# EAGLE design IOIO Rover (EAGLE 5.11)
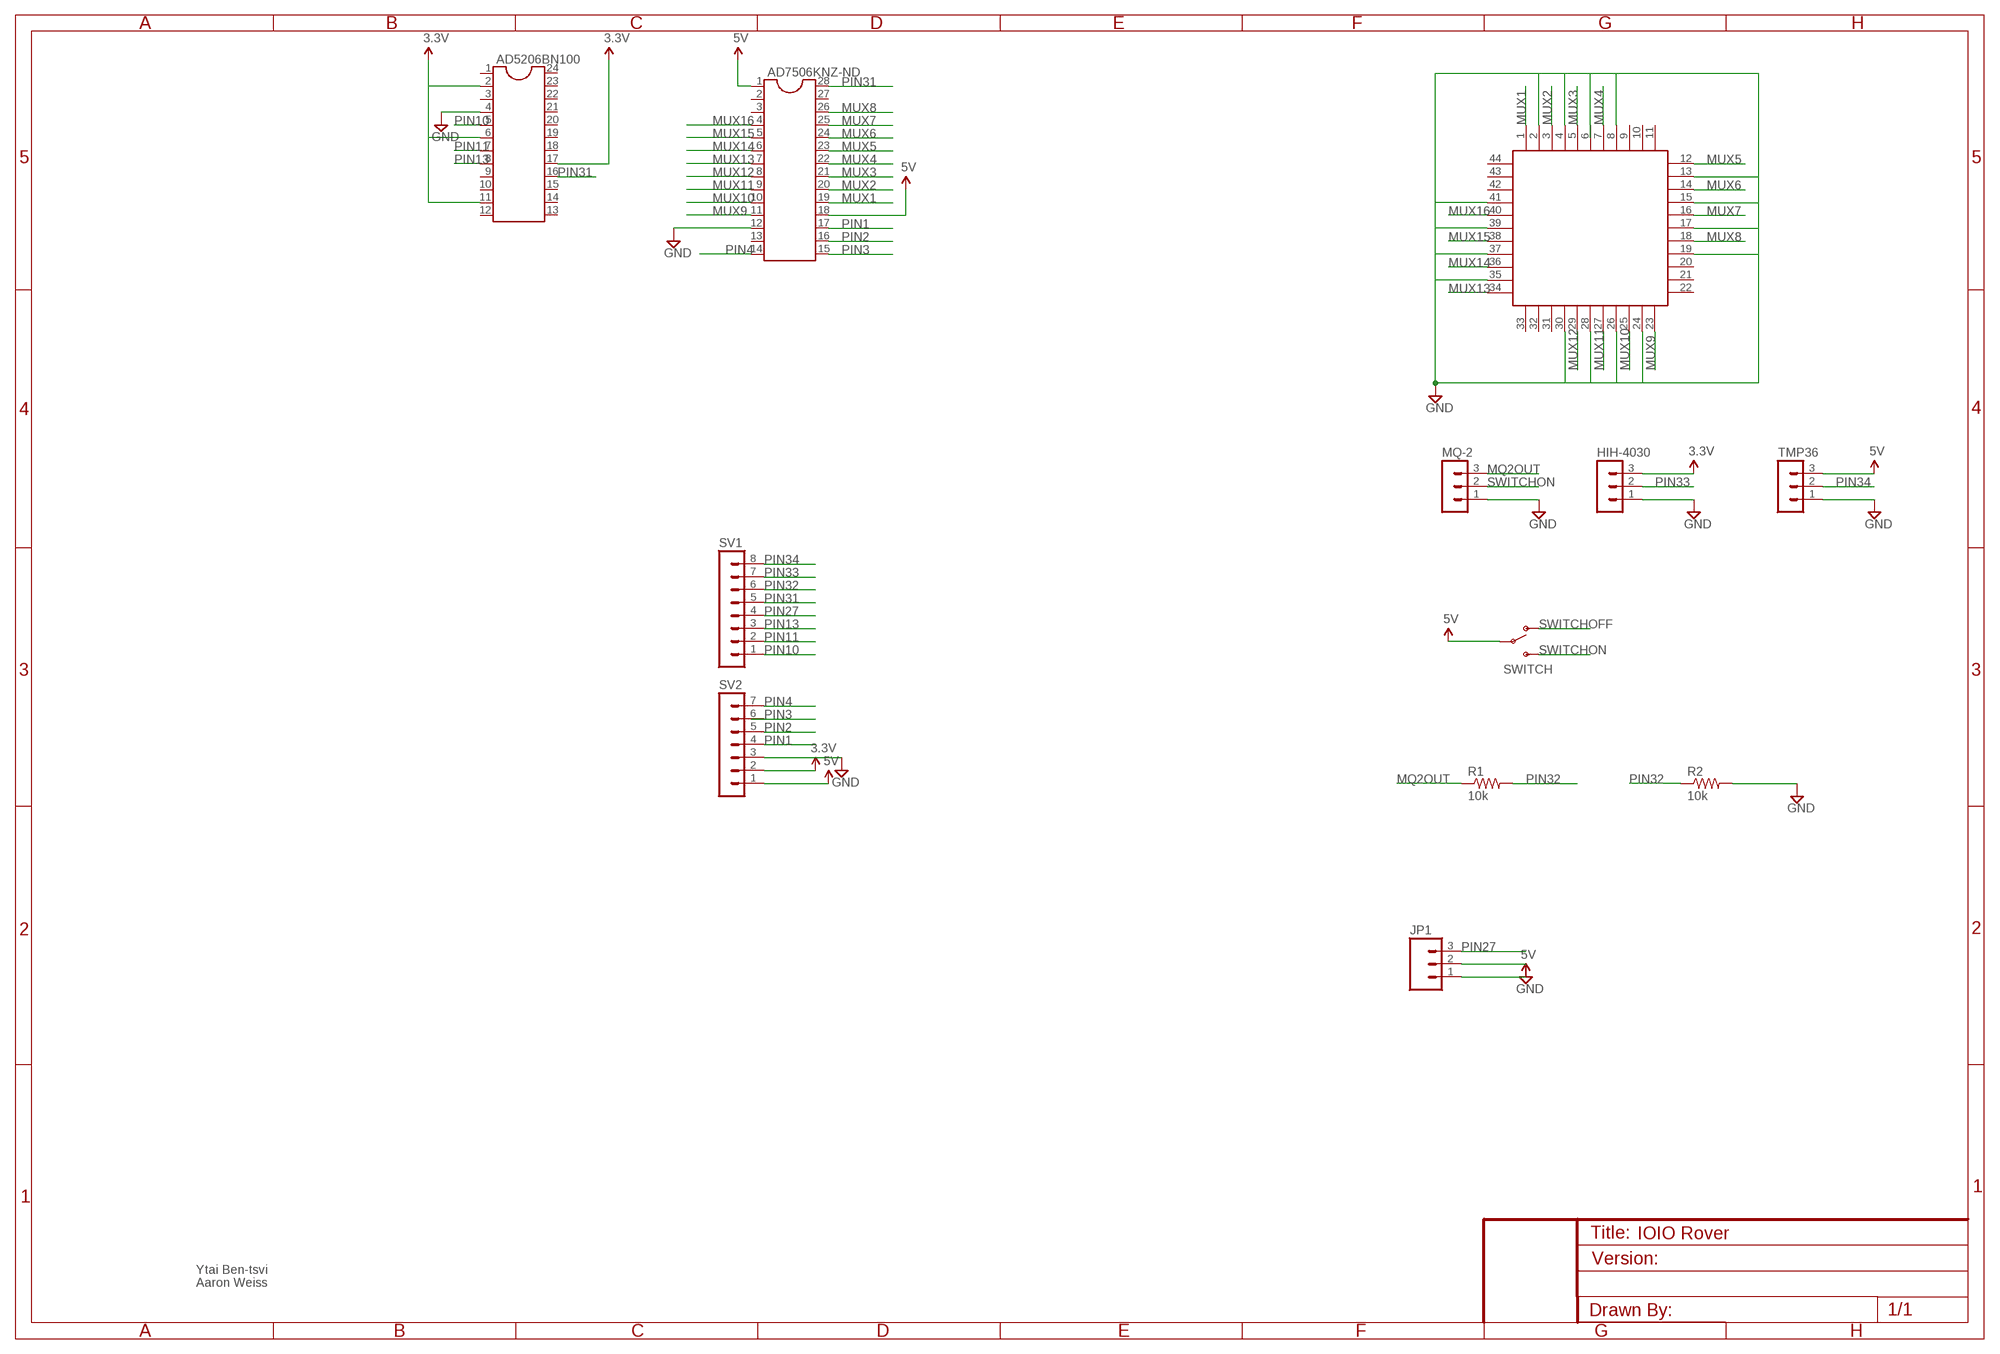
[diagram p0: schematic, sheet 1]

## Parts
AD5206BN100  DIL24-3  [DIL24-3]
AD7506KNZ-ND  DIL28  [DIL28-6]
HIH-4030  MA03-1  [MA03-1]
JP1  M03PTH  [1X03]
MQ-2  MA03-1  [MA03-1]
R1  10k  R-US_0207/7  [0207/7]
R2  10k  R-US_0207/7  [0207/7]
SV1  MA08-1  [MA08-1]
SV2  MA07-1  [MA07-1]
SWITCH  SWITCH-SPSTPTH  [SWITCH-SPDT]
TMP36  MA03-1  [MA03-1]
U$1  S44  [S44]

## Nets
3.3V: AD5206BN100.2 AD5206BN100.6 AD5206BN100.11 AD5206BN100.17 HIH-4030.3 SV2.2
5V: AD7506KNZ-ND.1 AD7506KNZ-ND.18 JP1.1 SV2.1 SWITCH.2(P) TMP36.3
GND: AD5206BN100.4 AD7506KNZ-ND.12 HIH-4030.1 JP1.2 MQ-2.1 R2.2 SV2.3 TMP36.1 U$1.2 U$1.4 U$1.8 U$1.13 U$1.15 U$1.17 U$1.19 U$1.24 U$1.26 U$1.28 U$1.30 U$1.35 U$1.37 U$1.39 U$1.41
MQ2OUT: MQ-2.3 R1.1
MUX1: AD7506KNZ-ND.19 U$1.1
MUX2: AD7506KNZ-ND.20 U$1.3
MUX3: AD7506KNZ-ND.21 U$1.5
MUX4: AD7506KNZ-ND.22 U$1.7
MUX5: AD7506KNZ-ND.23 U$1.12
MUX6: AD7506KNZ-ND.24 U$1.14
MUX7: AD7506KNZ-ND.25 U$1.16
MUX8: AD7506KNZ-ND.26 U$1.18
MUX9: AD7506KNZ-ND.11 U$1.23
MUX10: AD7506KNZ-ND.10 U$1.25
MUX11: AD7506KNZ-ND.9 U$1.27
MUX12: AD7506KNZ-ND.8 U$1.29
MUX13: AD7506KNZ-ND.7 U$1.34
MUX14: AD7506KNZ-ND.6 U$1.36
MUX15: AD7506KNZ-ND.5 U$1.38
MUX16: AD7506KNZ-ND.4 U$1.40
PIN1: AD7506KNZ-ND.17 SV2.4
PIN2: AD7506KNZ-ND.16 SV2.5
PIN3: AD7506KNZ-ND.15
PIN4: AD7506KNZ-ND.14 SV2.7
PIN10: AD5206BN100.5 SV1.1
PIN11: AD5206BN100.7 SV1.2
PIN13: AD5206BN100.8 SV1.3
PIN27: JP1.3 SV1.4
PIN31: AD5206BN100.16 AD7506KNZ-ND.28 SV1.5
PIN32: R1.2 R2.1 SV1.6
PIN33: HIH-4030.2 SV1.7
PIN34: SV1.8 TMP36.2
SWITCHOFF: SWITCH.1(O)
SWITCHON: MQ-2.2 SWITCH.3(S)
Unconnected: AD5206BN100.1 AD5206BN100.3 AD5206BN100.9 AD5206BN100.10 AD5206BN100.12 AD5206BN100.13 AD5206BN100.14 AD5206BN100.15 AD5206BN100.18 AD5206BN100.19 AD5206BN100.20 AD5206BN100.21 AD5206BN100.22 AD5206BN100.23 AD5206BN100.24 AD7506KNZ-ND.2 AD7506KNZ-ND.3 AD7506KNZ-ND.13 AD7506KNZ-ND.27 SV2.6 U$1.6 U$1.9 U$1.10 U$1.11 U$1.20 U$1.21 U$1.22 U$1.31 U$1.32 U$1.33 U$1.42 U$1.43 U$1.44

## Notes on the sheet
- Ytai Ben-tsvi
- Aaron Weiss

## Library data of the parts
AD5206BN100 = ic-package:DIL24: Dual In Line
AD7506KNZ-ND = ic-package:DIL28: Dual In Line
HIH-4030 MQ-2 TMP36 = con-lstb:MA03-1: PIN HEADER; OC_FARNELL: unknown; OC_NEWARK: unknown
JP1 = SparkFun:M03: Header 3 Standard 3-pin 0.1" header. Use with straight break away headers (SKU : PRT-00116), right angle break away headers (PRT-00553), swiss pins (PRT-00743), machine pins (PRT-00117), and female headers (PRT-00115). Molex polarized connector foot print use with SKU : PRT-08232 with associated crimp pins and housings.
R1 R2 = rcl:R-US_: RESISTOR, American symbol
SV1 = con-lstb:MA08-1: PIN HEADER; OC_FARNELL: unknown; OC_NEWARK: unknown
SV2 = con-lstb:MA07-1: PIN HEADER; OC_FARNELL: unknown; OC_NEWARK: unknown
SWITCH = SparkFun:SWITCH-SPST: SPST Switch Simple slide switch. Spark Fun Electronics SKU : COM-00102
U$1 = plcc-socket:S44: 44-pin PLCC through-hole socket

## Board
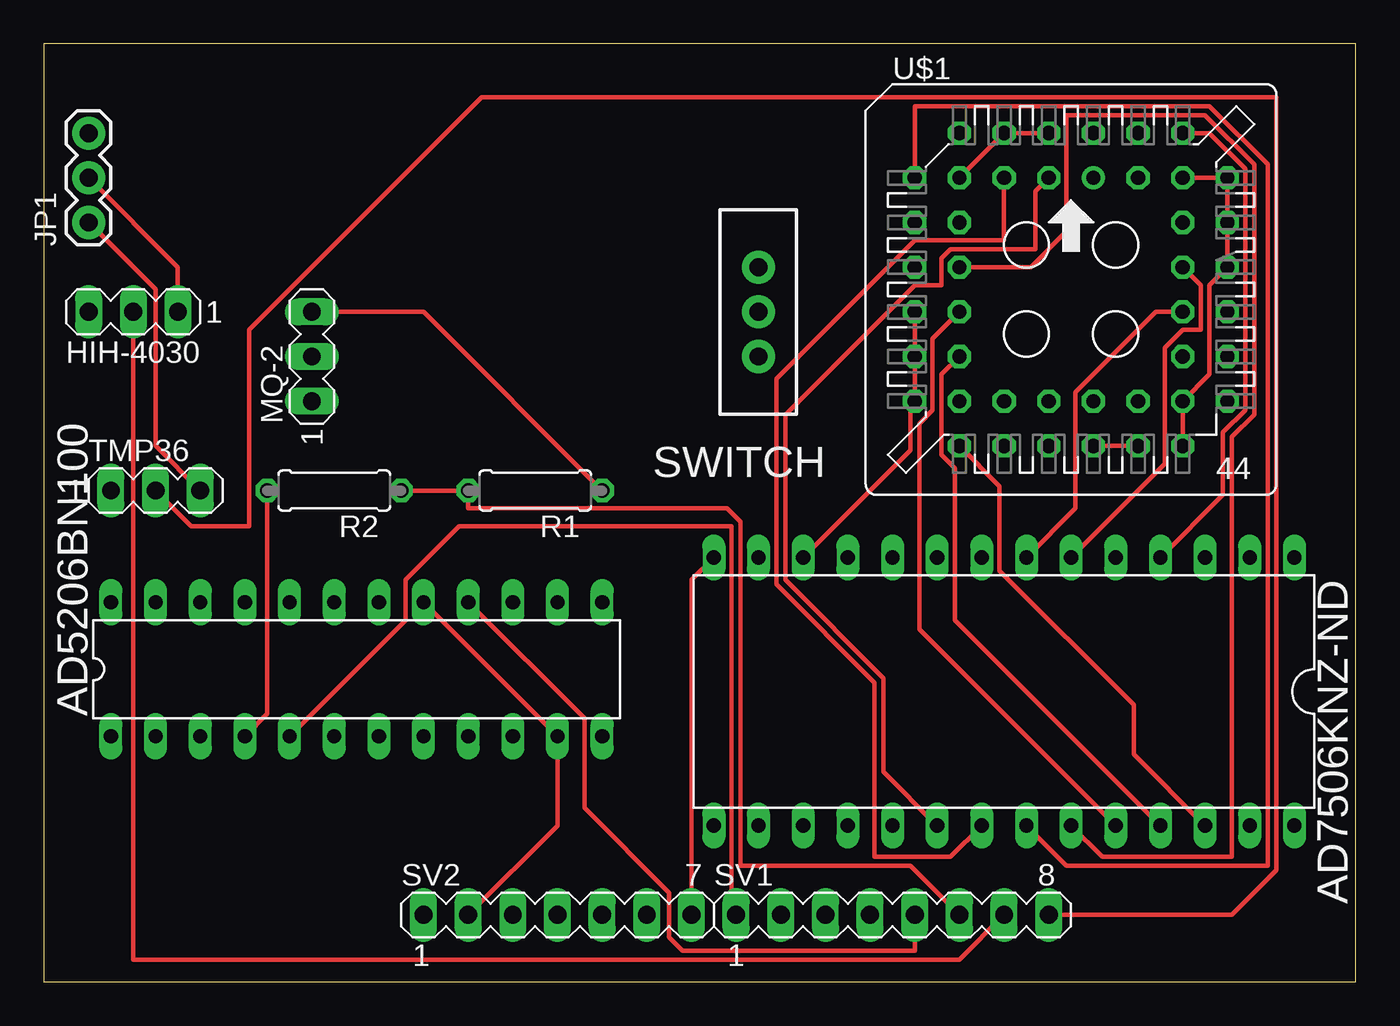
[diagram p1: board, top side]
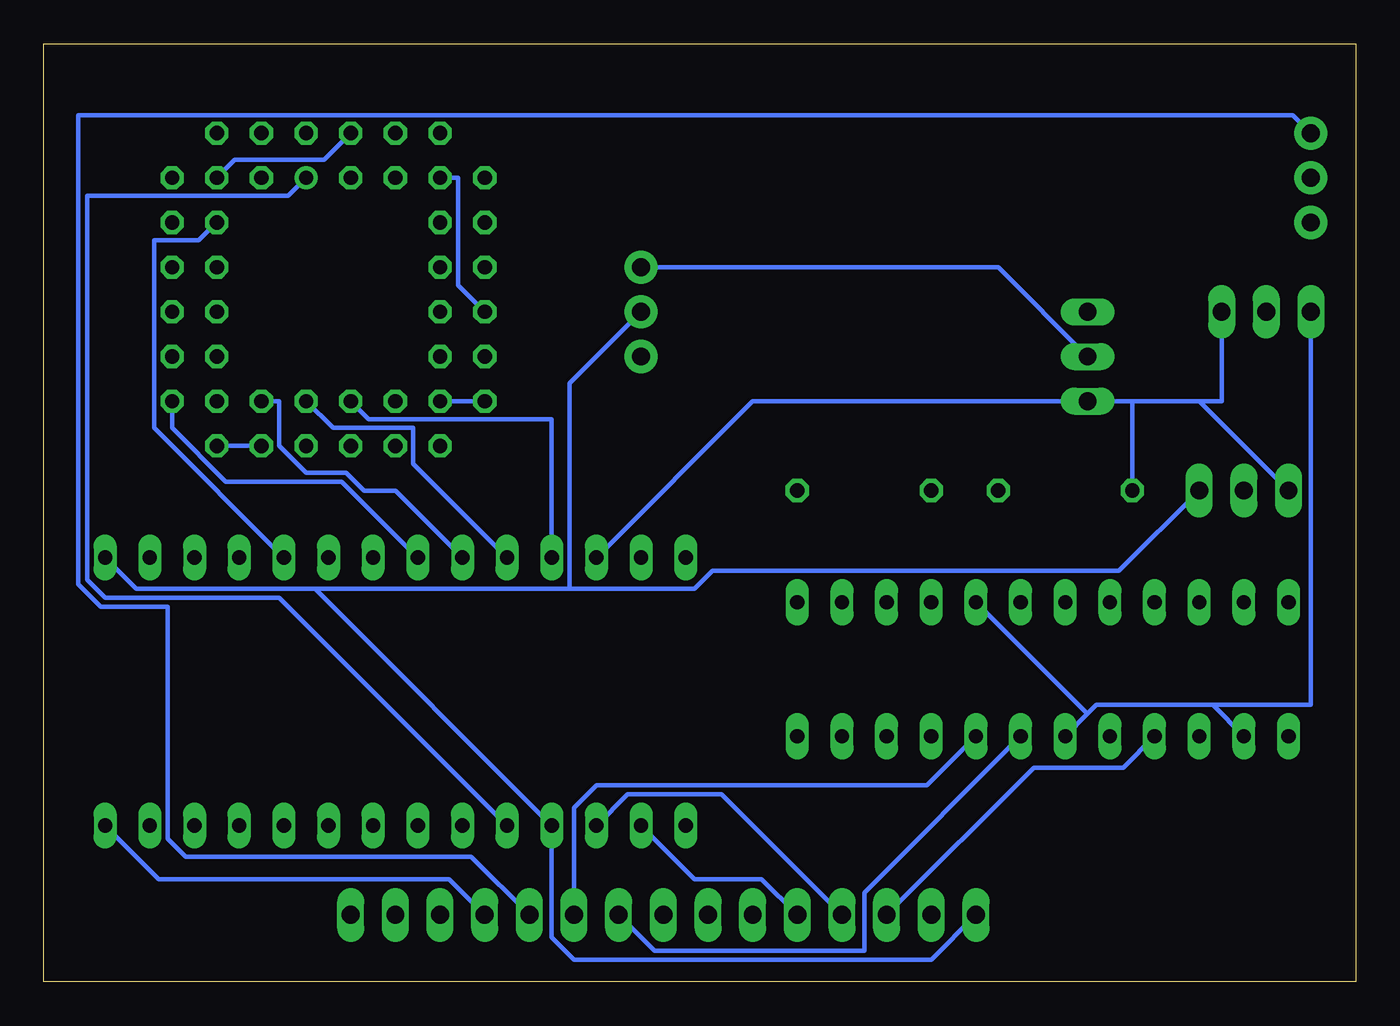
[diagram p2: board, bottom side, seen from below]

Size 74.6 x 53.33 mm. Coordinates in mm from the lower left corner, seen from the top.
Outline: 0,0 74.6,0 74.6,53.33 0,53.33 0,0
Copper layers (1*16): Top 0.035mm / dielectric 1.5mm / Bottom 0.035mm
Design rules "default": minimum track width 10mil, minimum drill 24mil, track to track 8mil, track to pad 8mil, pad to pad 8mil, via to via 8mil, smd to smd 8mil, copper to edge 40mil, drill to drill 8mil, minimum pad ring 10mil, minimum via ring 8mil, stop-mask expansion 4mil, vias tented up to drill 0mil, thermal gap 10mil

### Footprints (pad centres in the part's own frame; a part is rotated, then mirrored left to right if it is on the bottom)
DIL24-3 = drill 0.813 long: 1 -13.97,-3.81; 2 -11.43,-3.81; 3 -8.89,-3.81; 4 -6.35,-3.81; 5 -3.81,-3.81; 6 -1.27,-3.81; 7 1.27,-3.81; 8 3.81,-3.81; 9 6.35,-3.81; 10 8.89,-3.81; 11 11.43,-3.81; 12 13.97,-3.81; 13 13.97,3.81; 14 11.43,3.81; 15 8.89,3.81; 16 6.35,3.81; 17 3.81,3.81; 18 1.27,3.81; 19 -1.27,3.81; 20 -3.81,3.81; 21 -6.35,3.81; 22 -8.89,3.81; 23 -11.43,3.81; 24 -13.97,3.81
DIL28-6 = drill 0.813 long: 1 -16.51,-7.62; 2 -13.97,-7.62; 3 -11.43,-7.62; 4 -8.89,-7.62; 5 -6.35,-7.62; 6 -3.81,-7.62; 7 -1.27,-7.62; 8 1.27,-7.62; 9 3.81,-7.62; 10 6.35,-7.62; 11 8.89,-7.62; 12 11.43,-7.62; 13 13.97,-7.62; 14 16.51,-7.62; 15 16.51,7.62; 16 13.97,7.62; 17 11.43,7.62; 18 8.89,7.62; 19 6.35,7.62; 20 3.81,7.62; 21 1.27,7.62; 22 -1.27,7.62; 23 -3.81,7.62; 24 -6.35,7.62; 25 -8.89,7.62; 26 -11.43,7.62; 27 -13.97,7.62; 28 -16.51,7.62
MA03-1 = drill 1.016 long: 1 -2.54,0; 2 0,0; 3 2.54,0
1X03 = drill 1.016 pad 1.88 round: 1 0,0; 2 2.54,0; 3 5.08,0
0207/7 = drill 0.813 octagon: 1 -3.81,0; 2 3.81,0
MA08-1 = drill 1.016 long: 1 -8.89,0; 2 -6.35,0; 3 -3.81,0; 4 -1.27,0; 5 1.27,0; 6 3.81,0; 7 6.35,0; 8 8.89,0
MA07-1 = drill 1.016 long: 1 -7.62,0; 2 -5.08,0; 3 -2.54,0; 4 0,0; 5 2.54,0; 6 5.08,0; 7 7.62,0
SWITCH-SPDT = drill 1.016 pad 1.88 round: 1 0,2.54; 2 0,0; 3 0,-2.54
S44 = drill 0.813 round: 1 1.27,6.35 | drill 0.813 octagon: 2 -1.27,8.89; 3 -1.27,6.35; 4 -3.81,8.89; 5 -3.81,6.35; 6 -6.35,8.89; 7 -8.89,6.35; 8 -6.35,6.35; 9 -8.89,3.81; 10 -6.35,3.81; 11 -8.89,1.27; 12 -6.35,1.27; 13 -8.89,-1.27; 14 -6.35,-1.27; 15 -8.89,-3.81; 16 -6.35,-3.81; 17 -8.89,-6.35; 18 -6.35,-8.89; 19 -6.35,-6.35; 20 -3.81,-8.89; 21 -3.81,-6.35; 22 -1.27,-8.89; 23 -1.27,-6.35; 24 1.27,-8.89; 25 1.27,-6.35; 26 3.81,-8.89; 27 3.81,-6.35; 28 6.35,-8.89; 29 8.89,-6.35; 30 6.35,-6.35; 31 8.89,-3.81; 32 6.35,-3.81; 33 8.89,-1.27; 34 6.35,-1.27; 35 8.89,1.27; 36 6.35,1.27; 37 8.89,3.81; 38 6.35,3.81; 39 8.89,6.35; 40 6.35,8.89; 41 6.35,6.35; 42 3.81,8.89; 43 3.81,6.35; 44 1.27,8.89

### Placement (x,y rotation side)
AD5206BN100  17.78,17.78 0 top
AD7506KNZ-ND  54.61,16.51 180 top
HIH-4030  5.08,38.1 180 top
JP1  2.54,43.18 90 top
MQ-2  15.24,35.56 90 top
R1  27.94,27.94 180 top
R2  16.51,27.94 180 top
SV1  48.26,3.81 0 top
SV2  29.21,3.81 0 top
SWITCH  40.64,38.1 180 top
TMP36  6.35,27.94 0 top
U$1  58.42,39.37 0 top

### Tracks (layer width: path | path; a pad name or v marks a point on that pad's centre or on a via)
3.3V
  Top 0.254: AD5206BN100.17 AD5206BN100.11 29.21,8.89 SV2.2
  Bottom 0.254: AD5206BN100.2 8.13,15.75 | 8.13,15.75 14.73,15.75 15.24,15.24 | 15.24,15.24 AD5206BN100.6 | 15.24,15.24 AD5206BN100.17 | HIH-4030.3 2.54,15.75 8.13,15.75
5V
  Top 0.254: TMP36.3 6.35,30.48 6.35,39.37 JP1.1
  Bottom 0.254: 59.18,22.35 AD7506KNZ-ND.18 45.72,2.54 44.45,1.27 24.13,1.27 SV2.1 | 59.18,22.35 69.34,22.35 AD7506KNZ-ND.1 | SWITCH.2 44.7,34.04 44.7,22.35 | 59.18,22.35 44.7,22.35 | TMP36.3 13.46,23.37 36.58,23.37 37.59,22.35 44.7,22.35
GND
  Top 0.254: U$1.13 U$1.15 U$1.17 49.28,32.77 49.28,30.23 AD7506KNZ-ND.12 | U$1.8 U$1.4 U$1.2 | U$1.26 U$1.24 | U$1.28 U$1.30 66.29,34.54 66.29,39.62 U$1.35 U$1.37 U$1.39 U$1.41 | JP1.2 7.62,40.64 HIH-4030.1 | AD5206BN100.4 12.7,15.24 R2.2
  Bottom 0.254: U$1.17 U$1.19 | U$1.28 U$1.26 | U$1.2 58.67,46.74 63.75,46.74 U$1.41 | U$1.13 51.05,39.62 51.05,45.72 U$1.8 | 8.89,33.02 TMP36.1 | 12.7,33.02 MQ-2.1 34.29,33.02 AD7506KNZ-ND.12 | 12.7,33.02 8.89,33.02 | HIH-4030.1 7.62,33.02 8.89,33.02 | SV2.3 18.29,12.19 13.21,12.19 AD5206BN100.4 | R2.2 12.7,33.02
MQ2OUT
  Top 0.254: R1.1 21.59,38.1 MQ-2.3
MUX1
  Bottom 0.254: AD7506KNZ-ND.19 61.21,21.84 71.12,21.84 72.14,22.86 72.14,44.7 60.71,44.7 U$1.1
MUX2
  Top 0.254: AD7506KNZ-ND.20 47.75,11.94 47.75,17.27 42.16,22.86 42.16,32.26 49.53,39.62 51.05,39.62 51.05,41.15 51.56,41.66 56.39,41.66 56.39,44.96 U$1.3
MUX3
  Top 0.254: AD7506KNZ-ND.21 51.56,7.11 47.24,7.11 47.24,17.02 41.66,22.61 41.66,34.29 49.53,42.16 54.61,42.16 U$1.5
MUX4
  Top 0.254: AD7506KNZ-ND.22 58.17,6.6 69.6,6.6 69.6,46.48 66.29,49.78 49.53,49.78 U$1.7
MUX5
  Top 0.254: AD7506KNZ-ND.23 60.2,7.11 67.56,7.11 67.56,30.99 68.83,32.26 68.83,46.48 66.04,49.28 58.17,49.28 58.17,42.67 56.13,40.64 U$1.12
MUX6
  Top 0.254: AD7506KNZ-ND.24 49.78,20.07 49.78,31.75 50.55,32.51 50.55,36.58 U$1.14
MUX7
  Top 0.254: AD7506KNZ-ND.25 51.82,20.57 51.82,29.21 51.05,29.97 51.05,34.54 U$1.16
MUX8
  Top 0.254: AD7506KNZ-ND.26 61.98,12.95 61.98,15.75 54.36,23.37 54.36,28.19 U$1.18
MUX9
  Bottom 0.254: AD7506KNZ-ND.11 45.72,32 56.13,32 U$1.23
MUX10
  Bottom 0.254: AD7506KNZ-ND.10 53.59,29.46 53.59,31.5 58.17,31.5 U$1.25
MUX11
  Bottom 0.254: AD7506KNZ-ND.9 54.61,27.94 56.39,27.94 57.4,28.96 59.69,28.96 61.21,30.48 61.21,33.02 U$1.27
MUX12
  Bottom 0.254: AD7506KNZ-ND.8 57.66,28.45 64.26,28.45 67.31,31.5 U$1.29
MUX13
  Top 0.254: AD7506KNZ-ND.7 58.67,26.92 58.67,33.53 63.25,38.1 U$1.34
MUX14
  Top 0.254: AD7506KNZ-ND.6 63.75,29.46 63.75,36.07 64.77,37.08 65.79,37.08 65.79,39.62 U$1.36
MUX15
  Bottom 0.254: AD7506KNZ-ND.5 68.33,31.5 68.33,42.16 65.79,42.16 U$1.38
MUX16
  Top 0.254: AD7506KNZ-ND.4 67.06,27.69 67.06,31.24 68.33,32.51 68.33,46.23 66.29,48.26 U$1.40
PIN1
  Bottom 0.254: AD7506KNZ-ND.17 41.4,10.67 36.07,10.67 SV2.4
PIN2
  Bottom 0.254: AD7506KNZ-ND.16 37.59,5.84 33.78,5.84 SV2.5
PIN4
  Top 0.254: AD7506KNZ-ND.14 36.83,22.86 SV2.7
PIN10
  Top 0.254: AD5206BN100.5 20.57,20.57 20.57,22.86 23.62,25.91 39.12,25.91 39.12,4.06 SV1.1
PIN11
  Bottom 0.254: AD5206BN100.7 27.94,5.08 27.94,1.78 39.88,1.78 SV1.2
PIN13
  Bottom 0.254: AD5206BN100.8 24.38,11.18 43.18,11.18 44.45,9.91 SV1.3
PIN27
  Bottom 0.254: SV1.4 50.29,7.11 66.55,7.11 67.56,8.13 67.56,21.34 71.37,21.34 72.64,22.61 72.64,49.28 3.56,49.28 JP1.3
PIN31
  Top 0.254: AD5206BN100.16 30.73,14.99 30.73,9.91 35.56,5.08 35.56,2.54 36.32,1.78 49.53,1.78 SV1.5
  Bottom 0.254: AD7506KNZ-ND.28 68.07,5.84 51.56,5.84 SV1.5
PIN32
  Top 0.254: R2.1 R1.2 24.13,26.92 38.86,26.92 39.62,26.16 39.62,6.6 49.28,6.6 SV1.6
PIN33
  Top 0.254: SV1.7 52.07,1.27 5.08,1.27 HIH-4030.2
PIN34
  Top 0.254: TMP36.2 8.38,25.91 11.68,25.91 11.68,37.08 24.89,50.29 70.1,50.29 70.1,6.35 67.56,3.81 SV1.8
SWITCHON
  Bottom 0.254: MQ-2.2 20.32,40.64 SWITCH.3